# EAGLE design Tripple-LED (EAGLE 9.6.2)
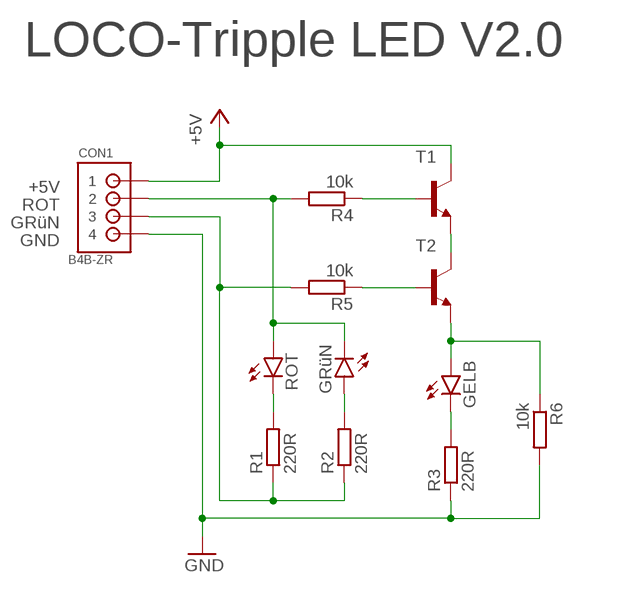
[diagram p0: schematic, sheet 1]

## Parts
CON1  B4B-ZR  [B4B-ZR]
GELB  LED5MM  [LED5MM]
GRüN  LED5MM  [LED5MM]
R1  220R  R-EU_R0402  [R0402]
R2  220R  R-EU_R0402  [R0402]
R3  220R  R-EU_R0402  [R0402]
R4  10k  R-EU_R0402  [R0402]
R5  10k  R-EU_R0402  [R0402]
R6  10k  R-EU_R0402  [R0402]
ROT  LED5MM  [LED5MM]
T1  -NPN-SOT23-EBC  [SOT23-EBC]
T2  -NPN-SOT23-EBC  [SOT23-EBC]

## Nets
+5V: CON1.1 T1.C
GND: CON1.4 R3.1 R6.2
GRüN: CON1.3 R1.1 R2.1 R5.2
N$2: GRüN.A R2.2
N$3: R1.2 ROT.K(C)
N$4: GELB.K(C) R3.2
N$7: R4.1 T1.B
N$8: R5.1 T2.B
N$9: T1.E T2.C
N$10: GELB.A R6.1 T2.E
ROT: CON1.2 GRüN.K(C) R4.2 ROT.A

## Notes on the sheet
- LOCO-Tripple LED V2.0

## Library data of the parts
CON1 = jst_zh:B4B-ZR: JST-ZH Connector 4 pol, 1.5mm pitch Package: B4B-ZR Source: http://www.jst-mfg.com/product/pdf/eng/eZH.pdf
GELB GRüN ROT = led:LED: LED OSRAM: - CHIPLED LG R971, LG N971, LY N971, LG Q971, LY Q971, LO R971, LY R971 LH N974, LH R974 LS Q976, LO Q976, LY Q976 LO Q996 - Hyper CHIPLED LW Q18S LB Q993, LB Q99A, LB R99A - SideLED LS A670, LO A670, LY A670, LG A670, LP A670 LB A673, LV A673, LT A673, LW A673 LH A674 LY A675 LS A676, LA A676, LO A676, LY A676, LW A676 LS A679, LY A679, LG A679 - Hyper Micro SIDELED® LS Y876, LA Y876, LO Y876, LY Y876 LT Y87S - SmartLED LW L88C, LW L88S LB L89C, LB L89S, LG L890 LS L89K, LO L89K, LY L89K LS L896, LA L896, LO L896, LY L896 - TOPLED LS T670, LO T670, LY T670, LG T670, LP T670 LSG T670, LSP T670, LSY T670, LOP T670, LYG T670 LG T671, LOG T671, LSG T671 LB T673, LV T673, LT T673, LW T673 LH T674 LS T676, LA T676, LO T676, LY T676, LB T676, LH T676, LSB T676, LW T676 LB T67C, LV T67C, LT T67C, LS T67K, LO T67K, LY T67K, LW E67C LS E67B, LA E67B, LO E67B, LY E67B, LB E67C, LV E67C, LT E67C LW T67C LS T679, LY T679, LG T679 LS T770, LO T770, LY T770, LG T770, LP T770 LB T773, LV T773, LT T773, LW T773 LH T774 LS E675, LA E675, LY E675, LS T675 LS T776, LA T776, LO T776, LY T776, LB T776 LHGB T686 LT T68C, LB T68C - Hyper Mini TOPLED® LB M676 - Mini TOPLED Santana® LG M470 LS M47K, LO M47K, LY M47K Source: http://www.osram.convergy.de LUXEON: - LUMILED® LXK2-PW12-R00, LXK2-PW12-S00, LXK2-PW14-U00, LXK2-PW14-V00 LXK2-PM12-R00, LXK2-PM12-S00, LXK2-PM14-U00 LXK2-PE12-Q00, LXK2-PE12-R00, LXK2-PE12-S00, LXK2-PE14-T00, LXK2-PE14-U00 LXK2-PB12-K00, LXK2-PB12-L00, LXK2-PB12-M00, LXK2-PB14-N00, LXK2-PB14-P00, LXK2-PB14-Q00 LXK2-PR12-L00, LXK2-PR12-M00, LXK2-PR14-Q00, LXK2-PR14-R00 LXK2-PD12-Q00, LXK2-PD12-R00, LXK2-PD12-S00 LXK2-PH12-R00, LXK2-PH12-S00 LXK2-PL12-P00, LXK2-PL12-Q00, LXK2-PL12-R00 Source: www.luxeon.com KINGBRIGHT: KA-3528ASYC Source: www.kingbright.com
R1-R6 = rcl:R-EU_: RESISTOR, European symbol; SPICEPREFIX: R
T1 T2 = transistor:*-NPN-: NPN Transistror BF959 corrected 2008.03.06

## Board
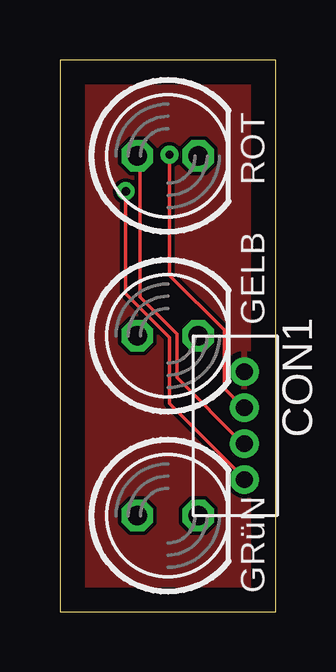
[diagram p1: board, top side]
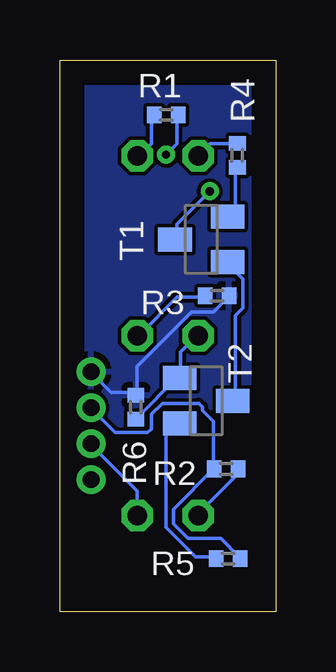
[diagram p2: board, bottom side, seen from below]

Size 9 x 23 mm. Coordinates in mm from the lower left corner, seen from the top.
Outline: 0,0 9,0 9,23 0,23 0,0
Copper layers (1*16): Top 0.035mm / dielectric 1.5mm / Bottom 0.035mm
Design rules "default": minimum track width 6mil, minimum drill 0.35mm, track to track 6mil, track to pad 6mil, pad to pad 6mil, via to via 6mil, smd to smd 6mil, copper to edge 40mil, drill to drill 6mil, minimum pad ring 10mil, minimum via ring 8mil, stop-mask expansion 4mil, vias tented up to drill 0mil, thermal gap 10mil

### Footprints (pad centres in the part's own frame; a part is rotated, then mirrored left to right if it is on the bottom)
B4B-ZR = drill 0.7: 1 6,-1.3; 2 4.5,-1.3; 3 3,-1.3; 4 1.5,-1.3
LED5MM = drill 0.813 octagon: A -1.27,0; K 1.27,0
R0402 = smd 0.6 x 0.7: 1 -0.5,0; 2 0.5,0
SOT23-EBC = smd 1 x 1.4: B 0.95,-1.1; C 0,1.1; E -0.95,-1.1

### Placement (x,y rotation side)
CON1  9,11.5 270 top
GELB  4.5,11.5 0 top
GRüN  4.5,4 0 top
R1  4.56,20.71 180 bottom
R2  2.06,5.95 0 bottom
R3  2.44,13.17 180 bottom
R4  1.6,19.02 90 bottom
R5  1.98,2.21 0 bottom
R6  5.83,8.52 90 bottom
ROT  4.5,19 0 top
T1  3.1,15.52 90 bottom
T2  2.9,8.79 270 bottom

### Tracks (layer width: path | path; a pad name or v marks a point on that pad's centre or on a via)
+5V  (via drill 0.35)
  Top 0.152: v2.74,17.53 2.74,13.26 4.57,11.43 4.57,8.69 7.62,5.64 CON1.1
  Bottom 0.152: v2.74,17.53 4.12,16.15 4.12,15.54 T1.C
GND
  Bottom 0.152: CON1.4 7.62,9.91 6.86,9.14 5.94,9.14 R6.2 5.79,9.14 5.79,10.21 3.5,12.5 2.59,12.5 1.98,13.11 R3.1
  pour Top: 0,23 0,0 9,0 9,23
  pour Bottom: 0,23 0,0 9,0 9,23
GRüN  (via drill 0.35)
  Top 0.152: v4.57,19.05 4.57,14.02 6.86,11.73 6.86,9.3 7.62,8.53 CON1.3
  Bottom 0.152: R5.2 1.52,2.29 2.29,3.05 3.66,3.05 4.27,3.66 4.27,4.27 2.59,5.94 R2.1 2.59,6.1 2.59,7.92 3.05,8.38 3.05,8.53 3.2,8.69 4.72,8.69 5.18,8.23 5.18,7.62 5.33,7.47 6.71,7.47 7.62,8.38 CON1.3 | v4.57,19.05 4.12,19.51 4.12,20.57 R1.1
N$2
  Bottom 0.152: R2.2 1.68,5.94 1.68,5.64 3.2,4.12 GRüN.A
N$3
  Bottom 0.152: R1.2 5.18,20.57 5.18,19.51 5.64,19.05 ROT.K
N$4
  Bottom 0.152: R3.2 3.05,13.11 4.12,13.11 5.64,11.58 GELB.K
N$7
  Bottom 0.152: R4.1 1.68,18.44 1.68,16.92 1.98,16.61 T1.B
N$8
  Bottom 0.152: R5.1 2.59,2.29 3.35,2.29 4.57,3.5 4.57,7.32 4.12,7.77 T2.B
N$9
  Bottom 0.152: T2.C 1.68,8.84 1.68,12.34 1.37,12.65 1.37,13.87 1.98,14.48 T1.E
N$10
  Bottom 0.152: R6.1 5.79,8.08 4.12,9.75 T2.E 3.96,9.75 3.96,10.82 3.35,11.43 GELB.A
ROT
  Top 0.152: ROT.A 3.35,18.9 3.35,13.11 4.88,11.58 4.88,9.75 7.62,7.01 CON1.2
  Bottom 0.152: R4.2 1.68,19.51 2.74,19.51 3.2,19.05 ROT.A | CON1.2 7.62,6.86 5.79,5.03 5.79,4.12 GRüN.K